# EAGLE design Calunium_v1 (EAGLE 5.11)
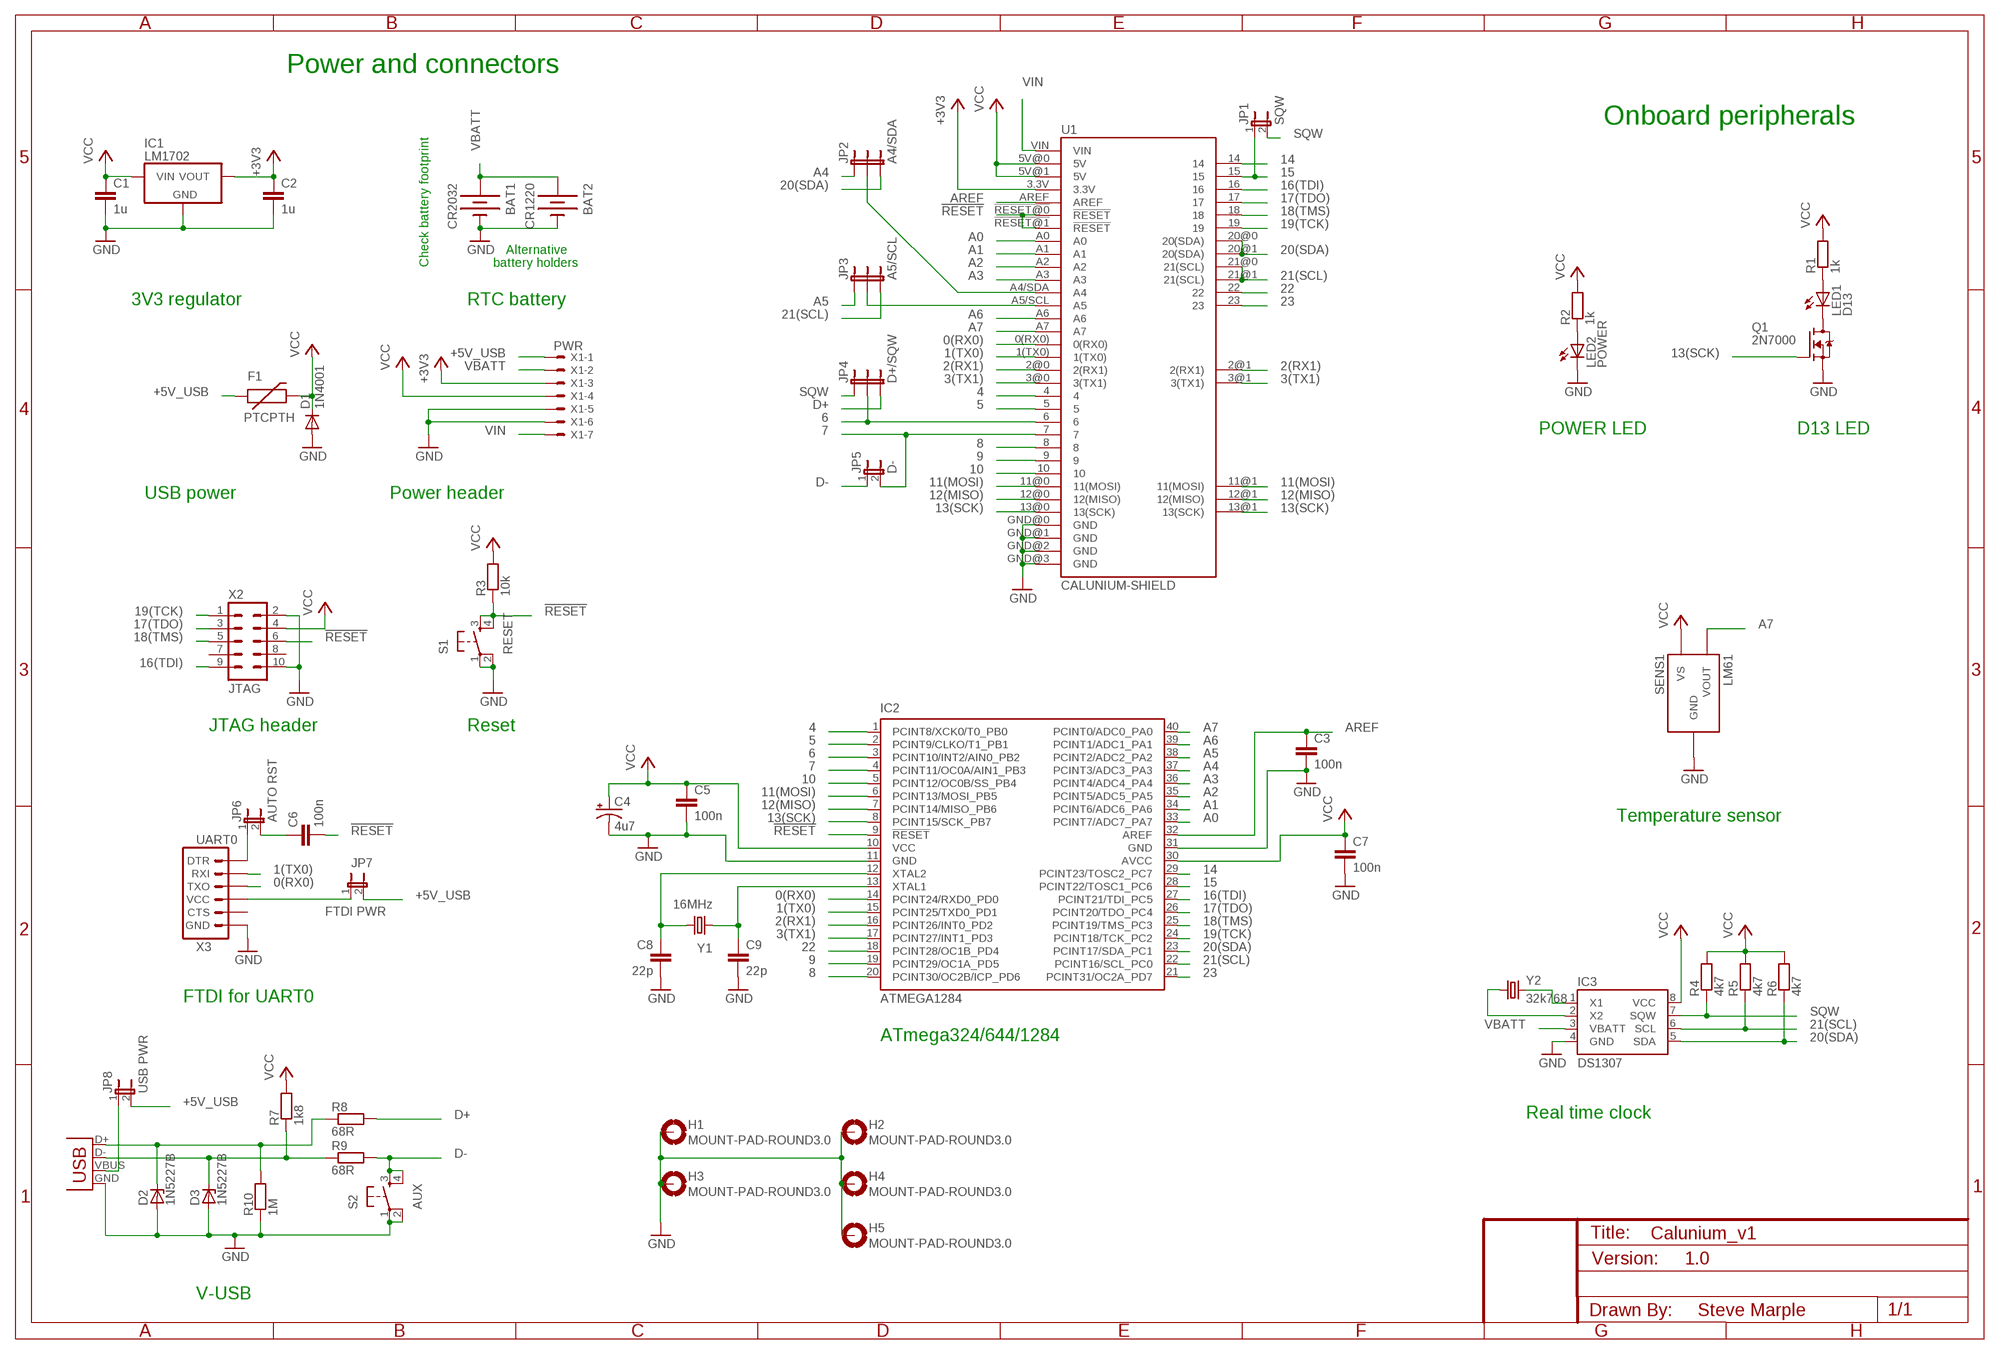
[diagram p0: schematic, sheet 1]

## Parts
BAT1  CR2032  BATTERY20PTH  [BATTCOM_20MM_PTH]
BAT2  CR1220  BATTERY12PTH  [BATTCON_12MM_PTH]
C1  1u  CAPPTH1  [CAP-PTH-5MM]
C2  1u  CAPPTH1  [CAP-PTH-5MM]
C3  100n  CAPPTH  [CAP-PTH-SMALL]
C4  4u7  CAP_POLPTH2  [CPOL-RADIAL-10UF-25V]
C5  100n  CAPPTH  [CAP-PTH-SMALL]
C6  100n  CAPPTH  [CAP-PTH-SMALL]
C7  100n  CAPPTH  [CAP-PTH-SMALL]
C8  22p  CAPPTH  [CAP-PTH-SMALL]
C9  22p  CAPPTH  [CAP-PTH-SMALL]
D1  1N4001  DIODEPTH  [DIODE-1N4001]
D2  1N5227B  ZENER-DIODEDO35Z10  [DO35Z10]
D3  1N5227B  ZENER-DIODEDO35Z10  [DO35Z10]
F1  PTCPTH  [PTC]
H1  MOUNT-PAD-ROUND3.0  [3,0-PAD]
H2  MOUNT-PAD-ROUND3.0  [3,0-PAD]
H3  MOUNT-PAD-ROUND3.0  [3,0-PAD]
H4  MOUNT-PAD-ROUND3.0  [3,0-PAD]
H5  MOUNT-PAD-ROUND3.0  [3,0-PAD]
IC1  LM1702  [TO-92]
IC2  ATMEGA1284  ATMEGA644-20PU  [DIL40]
IC3  DS1307  DS1307DIL08  [DIL08]
JP1  SQW  JUMPER-2PTH  [1X02]
JP2  A4/SDA  JUMPER-3PTH  [1X03]
JP3  A5/SCL  JUMPER-3PTH  [1X03]
JP4  D+/SQW  JUMPER-3PTH  [1X03]
JP5  D-  JUMPER-2PTH  [1X02]
JP6  AUTO RST  JUMPER-2PTH  [1X02]
JP7  FTDI PWR  JUMPER-2PTH  [1X02]
JP8  USB PWR  JUMPER-2PTH  [1X02]
LED1  D13  LED3MM  [LED3MM]
LED2  POWER  LED3MM  [LED3MM]
Q1  2N7000  [TO-92]
R1  1k  RESISTOR  [RES-AXIAL-0.4]
R2  1k  RESISTOR  [RES-AXIAL-0.4]
R3  10k  RESISTOR  [RES-AXIAL-0.4]
R4  4k7  RESISTOR  [RES-AXIAL-0.4]
R5  4k7  RESISTOR  [RES-AXIAL-0.4]
R6  4k7  RESISTOR  [RES-AXIAL-0.4]
R7  1k8  RESISTOR  [RES-AXIAL-0.4]
R8  68R  RESISTOR  [RES-AXIAL-0.4]
R9  68R  RESISTOR  [RES-AXIAL-0.4]
R10  1M  RESISTOR  [RES-AXIAL-0.4]
S1  RESET  TAC_SWITCHPTH  [TACTILE-PTH]
S2  AUX  TAC_SWITCHPTH  [TACTILE-PTH]
SENS1  LM61  [TO-92]
U1  CALUNIUM-SHIELD  [CALUNIUM-SHIELD-NO-OUTLINE-NO-HOLES]
X1  PWR  22-23-2071  [22-23-2071]
X2  JTAG  ATMEL-JTAG  [CON-HARTING-ML10]
X3  UART0  ARDUINO_SERIAL_PROGRAMRA_LOCK  [MOLEX-1X6-RA_LOCK]
X4  USBPTH  [USB-B-PTH]
Y1  16MHz  CRYSTALHC49UV  [HC49U-V]
Y2  32k768  CRYSTALTC38H  [TC38H]

## Nets
0(RX0): IC2.14(PCINT24/RXD0_PD0) U1.0(RX0) X3.4(TXO)
1(TX0): IC2.15(PCINT25/TXD0_PD1) U1.1(TX0) X3.5(RXI)
2(RX1): IC2.16(PCINT26/INT0_PD2) U1.2@0(2(RX1)) U1.2@1(2(RX1))
3(TX1): IC2.17(PCINT27/INT1_PD3) U1.3@0(3(TX1)) U1.3@1(3(TX1))
4: IC2.1(PCINT8/XCK0/T0_PB0) U1.4
5: IC2.2(PCINT9/CLKO/T1_PB1) U1.5
6: IC2.3(PCINT10/INT2/AIN0_PB2) JP4.2 U1.6
7: IC2.4(PCINT11/OC0A/AIN1_PB3) JP5.2 U1.7
8: IC2.20(PCINT30/OC2B/ICP_PD6) U1.8
9: IC2.19(PCINT29/OC1A_PD5) U1.9
10: IC2.5(PCINT12/OC0B/SS_PB4) U1.10
11(MOSI): IC2.6(PCINT13/MOSI_PB5) U1.11@0(11(MOSI)) U1.11@1(11(MOSI))
12(MISO): IC2.7(PCINT14/MISO_PB6) U1.12@0(12(MISO)) U1.12@1(12(MISO))
13(SCK): IC2.8(PCINT15/SCK_PB7) Q1.2(G) U1.13@0(13(SCK)) U1.13@1(13(SCK))
14: IC2.29(PCINT23/TOSC2_PC7) U1.14
15: IC2.28(PCINT22/TOSC1_PC6) JP1.1 U1.15
16(TDI): IC2.27(PCINT21/TDI_PC5) U1.16 X2.9(TDI)
17(TDO): IC2.26(PCINT20/TDO_PC4) U1.17 X2.3(TDO)
18(TMS): IC2.25(PCINT19/TMS_PC3) U1.18 X2.5(TMS)
19(TCK): IC2.24(PCINT18/TCK_PC2) U1.19 X2.1(TCK)
20(SDA): IC2.23(PCINT17/SDA_PC1) IC3.5(SDA) JP2.3 R6.P$1 U1.20@0(20(SDA)) U1.20@1(20(SDA))
21(SCL): IC2.22(PCINT16/SCL_PC0) IC3.6(SCL) JP3.3 R5.P$1 U1.21@0(21(SCL)) U1.21@1(21(SCL))
22: IC2.18(PCINT28/OC1B_PD4) U1.22
23: IC2.21(PCINT31/OC2A_PD7) U1.23
!RESET: C6.2 IC2.9(!RESET) R3.P$1 S1.3 S1.4 U1.!RESET@0(!RESET) U1.!RESET@1(!RESET) X2.6(!SRST)
+3V3 [power]: C2.1 IC1.3(VOUT) U1.3.3V X1.3
+5V_USB [power]: F1.P$1 JP7.2 JP8.2 X1.1
A0: IC2.33(PCINT7/ADC7_PA7) U1.A0
A1: IC2.34(PCINT6/ADC6_PA6) U1.A1
A2: IC2.35(PCINT5/ADC5_PA5) U1.A2
A3: IC2.36(PCINT4/ADC4_PA4) U1.A3
A4: IC2.37(PCINT3/ADC3_PA3) JP2.1
A5: IC2.38(PCINT2/ADC2_PA2) JP3.1
A6: IC2.39(PCINT1/ADC1_PA1) U1.A6
A7: IC2.40(PCINT0/ADC0_PA0) SENS1.2(VOUT) U1.A7
AREF: C3.1 IC2.32(AREF) U1.AREF
D+: JP4.3 R8.P$2
D-: JP5.1 R9.P$2 S2.3 S2.4
GND [power]: BAT1.2(-) BAT2.GND(-) C1.2 C2.2 C3.2 C4.2(-) C5.2 C7.2 C8.2 C9.2 D1.A D2.A D3.A H1.B3,0(MOUNT) H2.B3,0(MOUNT) H3.B3,0(MOUNT) H4.B3,0(MOUNT) H5.B3,0(MOUNT) IC1.1(GND) IC2.11(GND) IC2.31(GND) IC3.4(GND) LED2.K(C) Q1.1(S) R10.P$1 S1.1 S1.2 S2.1 S2.2 SENS1.3(GND) U1.GND@0(GND) U1.GND@1(GND) U1.GND@2(GND) U1.GND@3(GND) X1.5 X1.6 X2.2(GND) X2.10(GND) X3.1(GND) X4.GND
N$1: C9.1 IC2.13(XTAL1) Y1.1
N$2: C8.1 IC2.12(XTAL2) Y1.2
N$3: LED1.A R1.P$1
N$4: LED1.K(C) Q1.3(D)
N$5: IC3.1(X1) Y2.2
N$6: JP2.2 U1.A4/SDA(A4)
N$7: IC3.2(X2) Y2.1
N$8: LED2.A R2.P$1
N$9: JP8.1 X4.VBUS
N$10: JP7.1 X3.3(VCC)
N$11: D3.C R7.P$1 R9.P$1 X4.D-
N$13: JP3.2 U1.A5/SCL(A5)
N$15: JP6.1 X3.6(DTR)
N$16: C6.1 JP6.2
N$27: D2.C R8.P$1 R10.P$2 X4.D+
SQW: IC3.7(SQW) JP1.2 JP4.1 R4.P$1
VBATT: BAT1.1(+) BAT2.VCC@1(+) IC3.3(VBATT) X1.2
VCC [power]: C1.1 C4.1(+) C5.1 C7.1 D1.C F1.P$2 IC1.2(VIN) IC2.10(VCC) IC2.30(AVCC) IC3.8(VCC) R1.P$2 R2.P$2 R3.P$2 R4.P$2 R5.P$2 R6.P$2 R7.P$2 SENS1.1(VS) U1.5V@0(5V) U1.5V@1(5V) X1.4 X2.4(VTREF)
VIN [power]: U1.VIN X1.7
Unconnected: X2.7(NC) X2.8(NC) X3.2(CTS)

## Notes on the sheet
- Power and connectors
- Onboard peripherals
- Alternative
- Check battery footprint | battery holders
- 3V3 regulator | RTC battery
- POWER LED | D13 LED
- USB power | Power header
- JTAG header | Reset
- Temperature sensor
- FTDI for UART0
- ATmega324/644/1284
- Real time clock
- 1.0
- V-USB
- Steve Marple

## Library data of the parts
BAT1 BAT2 = SparkFun:BATTERY: Battery Holders Various common sizes : AA, AAA, 20mm coin cell and 12mm coin cell.
C1-C3 C5-C9 = SparkFun:CAP: Capacitor Standard 0603 ceramic capacitor, and 0.1" leaded capacitor.
C4 = SparkFun:CAP_POL: Capacitor Polarized These are standard SMD and PTH capacitors. Normally 10uF, 47uF, and 100uF in electrolytic and tantalum varieties. Always verify the external diameter of the through hole cap, it varies with capacity, voltage, and manufacturer. The EIA devices should be standard.
D1 = SparkFun:DIODE: Diode These are standard reverse protection diodes and small signal diodes. SMA package can handle up to about 1A. SOD-323 can handle about 200mA. What the SOD-323 package when ordering, there are some mfgs out there that are 5-pin packages.
D2 D3 = diode:ZENER-DIODE: Z-Diode
F1 = SparkFun:PTC: Resettable Fuse PTC Resettable Fuse. Spark Fun Electronics SKU : COM-08357
H1-H5 = holes:MOUNT-PAD-ROUND: MOUNTING PAD, round
IC1 = SteveMarple:LM1702
IC2 = atmel:ATMEGA644-*PU: 8-bit Microcontroller with 64K Bytes In-System Programmable Flash Auto generated by make-symbol-device-package-bsdl.ulp Rev. 34 Source: http://www.atmel.com/dyn/resources/prod_documents/doc2593.pdf; MPN: ATMEGA644-20PU; OC_FARNELL: 1288340; OC_NEWARK: 23M5060
IC3 = SteveMarple:DS1307
JP1 JP5-JP8 = SparkFun:JUMPER-2: Jumper Basic 0.1" spaced jumper. Use with breakaway headers.
JP2-JP4 = SparkFun:JUMPER-3
LED1 LED2 = SparkFun:LED: LEDs Standard schematic elements and footprints for 5mm, 3mm, 1206, and 0603 sized LEDs. 5mm - Spark Fun Electronics SKU : COM-00529 (and others)
Q1 = SteveMarple:2N7000: Microchip MCP1702 5V low dropout voltage regulator
R1-R10 = SteveMarple:RESISTOR: 1/4W PTH resistor
S1 S2 = SparkFun:TAC_SWITCH: Momentary Switch Button commonly used for reset or general input. Spark Fun Electronics SKU : COM-00097
SENS1 = SteveMarple:LM61
U1 = SteveMarple:CALUNIUM-SHIELD
X1 = con-molex:22-23-2071: .100" (2.54mm) Center Header - 7 Pin; MF: MOLEX; MPN: 22-23-2071; OC_FARNELL: 1654534; OC_NEWARK: 56H0445
X2 = SteveMarple:ATMEL-JTAG: ATMEL JTAG header
X3 = SparkFun:ARDUINO_SERIAL_PROGRAM
X4 = SteveMarple:USB: USB Connectors USB-B-PTH is fully proven SKU : PRT-00139 USB-miniB is fully proven SKU : PRT-00587 USB-A-PCB is untested. USB-A-H is throughly reviewed, but untested. Spark Fun Electronics SKU : PRT-00437 USB-B-SMT is throughly reviewed, but untested. Needs silkscreen touching up. USB-A-S has not been used/tested USB-MB-H has not been used/tested
Y1 Y2 = SparkFun:CRYSTAL: Crystals Various standard crystals. Proven footprints. Spark Fun Electronics SKU : COM-00534

## Net classes
1 power: width 0.381 mm

## Board
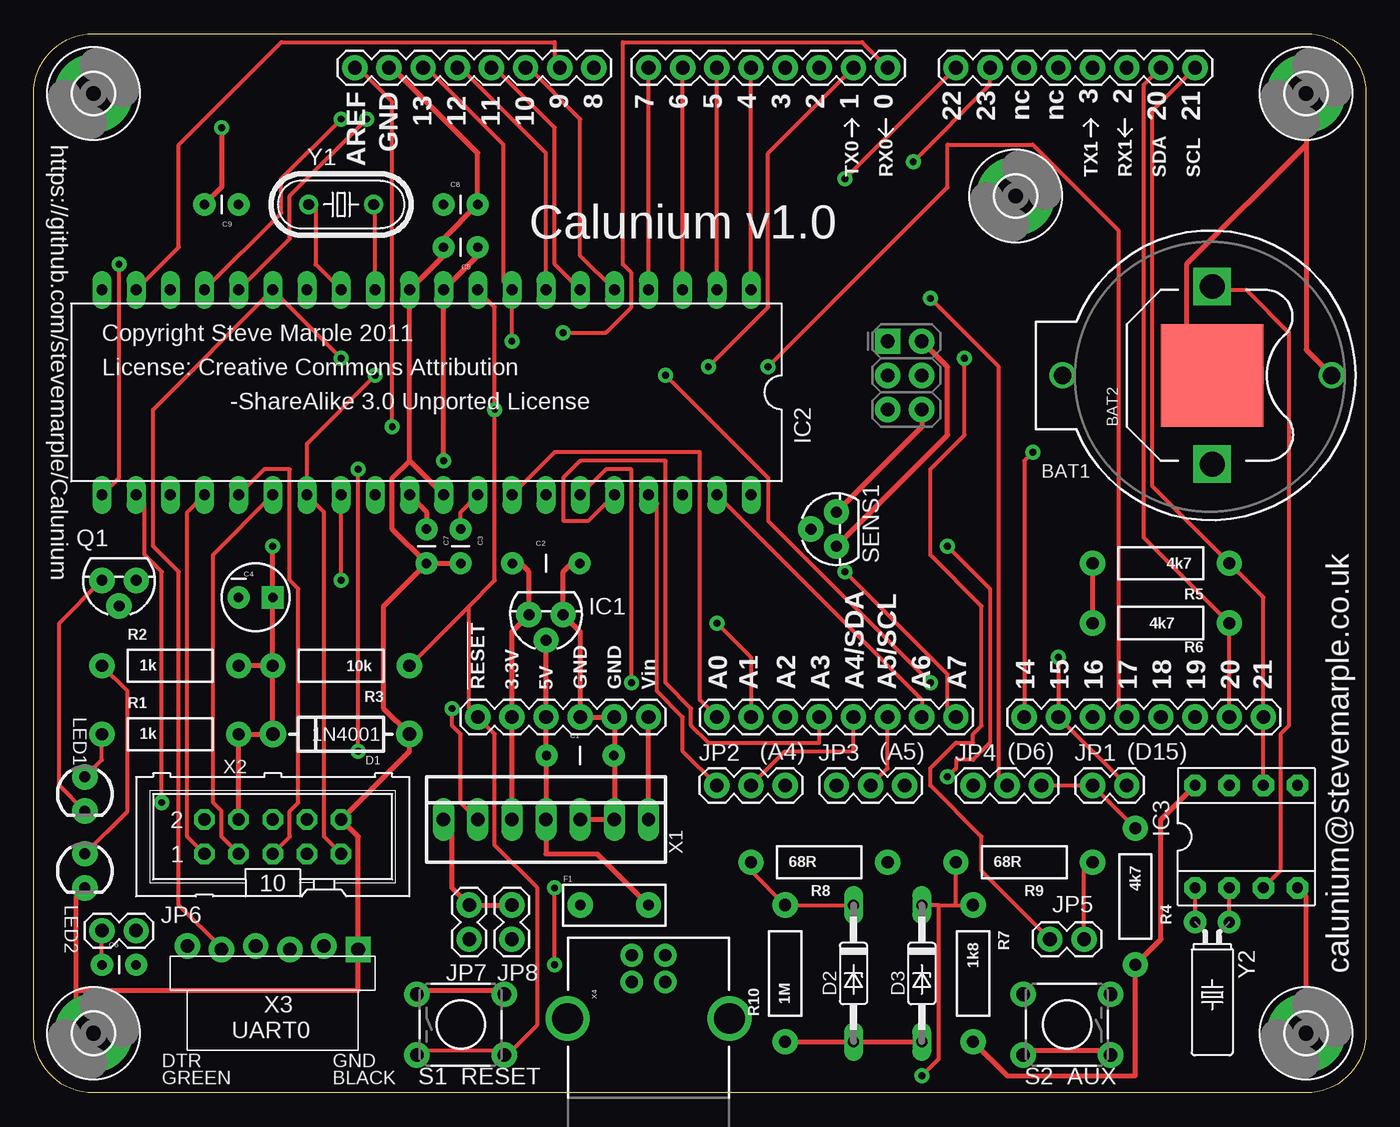
[diagram p1: board, top side]
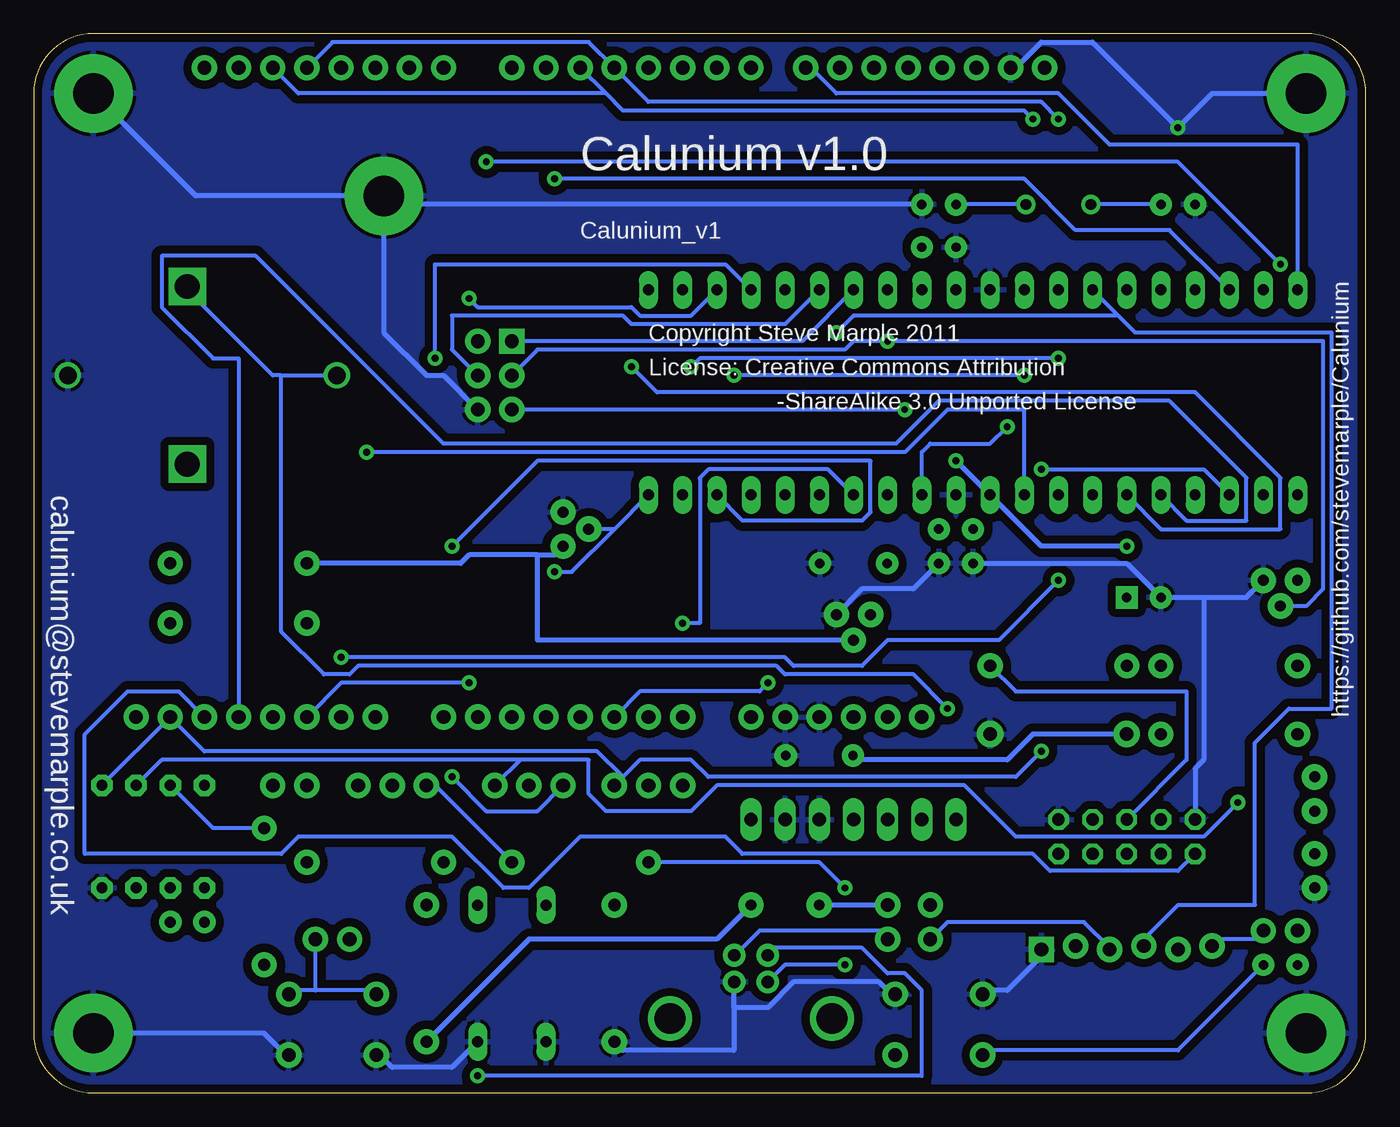
[diagram p2: board, bottom side, seen from below]

Size 99.06 x 78.74 mm. Coordinates in mm from the lower left corner, seen from the top.
Outline: 0,74.3 arc-90 4.45,78.74 94.61,78.74 arc-90 99.06,74.3 99.06,4.45 arc-90 94.61,0 4.45,0 arc-90 0,4.45 0,74.3
Copper layers (1*16): Top 0.035mm / dielectric 1.5mm / Bottom 0.035mm
Design rules "SparkFun_very_conservative": minimum track width 12mil, minimum drill 20mil, track to track 12mil, track to pad 12mil, pad to pad 12mil, via to via 12mil, smd to smd 12mil, copper to edge 10mil, drill to drill 8mil, minimum pad ring 12mil, minimum via ring 12mil, stop-mask expansion 4mil, vias tented up to drill 25mil, thermal gap 10mil

### Footprints (pad centres in the part's own frame; a part is rotated, then mirrored left to right if it is on the bottom)
BATTCOM_20MM_PTH = drill 1.3 round: 1 20,0; 2 0,0
BATTCON_12MM_PTH = smd 7.62 x 7.62: GND 0,0 | drill 1.854 square: VCC@1 -6.604,0; VCC@2 6.604,0
CAP-PTH-5MM = drill 0.7 pad 1.651 round: 1 -2.5,0; 2 2.5,0
CAP-PTH-SMALL = drill 0.7 pad 1.651 round: 1 0,0; 2 2.54,0
CPOL-RADIAL-10UF-25V = drill 0.7 pad 1.651 square: 1 1.27,0 | drill 0.7 pad 1.651 round: 2 -1.27,0
DIODE-1N4001 = drill 1 pad 1.981 round: A -5.08,0; C 5.08,0
DO35Z10 = drill 0.813 long: A 5.08,0; C -5.08,0
PTC = drill 0.8 pad 1.88 round: P$1 -2.54,0; P$2 2.54,0
3,0-PAD = drill 3 pad 5.842 round: B3,0 0,0
TO-92 = drill 0.813 pad 1.88 round: 1 -1.27,0; 2 0,1.905; 3 1.27,0
DIL40 = drill 0.813 long: 1 -24.13,-7.62; 2 -21.59,-7.62; 3 -19.05,-7.62; 4 -16.51,-7.62; 5 -13.97,-7.62; 6 -11.43,-7.62; 7 -8.89,-7.62; 8 -6.35,-7.62; 9 -3.81,-7.62; 10 -1.27,-7.62; 11 1.27,-7.62; 12 3.81,-7.62; 13 6.35,-7.62; 14 8.89,-7.62; 15 11.43,-7.62; 16 13.97,-7.62; 17 16.51,-7.62; 18 19.05,-7.62; 19 21.59,-7.62; 20 24.13,-7.62; 21 24.13,7.62; 22 21.59,7.62; 23 19.05,7.62; 24 16.51,7.62; 25 13.97,7.62; 26 11.43,7.62; 27 8.89,7.62; 28 6.35,7.62; 29 3.81,7.62; 30 1.27,7.62; 31 -1.27,7.62; 32 -3.81,7.62; 33 -6.35,7.62; 34 -8.89,7.62; 35 -11.43,7.62; 36 -13.97,7.62; 37 -16.51,7.62; 38 -19.05,7.62; 39 -21.59,7.62; 40 -24.13,7.62
DIL08 = drill 0.813 pad 1.6 octagon: 1 -3.81,-3.81; 2 -1.27,-3.81; 3 1.27,-3.81; 4 3.81,-3.81; 5 3.81,3.81; 6 1.27,3.81; 7 -1.27,3.81; 8 -3.81,3.81
1X02 = drill 1.016 pad 1.88 round: 1 0,0; 2 2.54,0
1X03 = drill 1.016 pad 1.88 round: 1 0,0; 2 2.54,0; 3 5.08,0
LED3MM = drill 0.813 pad 1.88 round: A -1.27,0; K 1.27,0
RES-AXIAL-0.4 = drill 0.9 pad 1.88 round: P$1 -5.08,0; P$2 5.08,0
TACTILE-PTH = drill 1.016 pad 1.88 round: 1 -3.251,2.261; 2 3.251,2.261; 3 -3.251,-2.261; 4 3.251,-2.261
CALUNIUM-SHIELD-NO-OUTLINE-NO-HOLES = drill 1.016 pad 1.88 round: 0(RX0) 0,21.59; 1(TX0) -2.54,21.59; 2@0 -5.08,21.59; 2@1 17.78,21.59; 3.3V -27.94,-26.67; 3@0 -7.62,21.59; 3@1 15.24,21.59; 4 -10.16,21.59; 5 -12.7,21.59; 5V@0 -25.4,-26.67; 5V@1 2.54,1.27; 6 -15.24,21.59; 7 -17.78,21.59; 8 -21.844,21.59; 9 -24.384,21.59; 10 -26.924,21.59; 11@0 -29.464,21.59; 11@1 2.54,-1.27; 12@0 -32.004,21.59; 13@0 -34.544,21.59; 13@1 0,-1.27; 14 10.16,-26.67; 15 12.7,-26.67; 16 15.24,-26.67; 17 17.78,-26.67; 18 20.32,-26.67; 19 22.86,-26.67; 20@0 25.4,-26.67; 20@1 20.32,21.59; 21@0 27.94,-26.67; 21@1 22.86,21.59; 22 5.08,21.59; 23 7.62,21.59; !RESET@0 -30.48,-26.67; !RESET@1 0,-3.81; A0 -12.7,-26.67; A1 -10.16,-26.67; A2 -7.62,-26.67; A3 -5.08,-26.67; A4/SDA -2.54,-26.67; A5/SCL 0,-26.67; A6 2.54,-26.67; A7 5.08,-26.67; AREF -39.624,21.59; GND@0 -22.86,-26.67; GND@1 -20.32,-26.67; GND@2 -37.084,21.59; GND@3 2.54,-3.81; NC@0 12.7,21.59; NC@1 10.16,21.59; VIN -17.78,-26.67 | drill 1.016 pad 1.88 square: 12@1 0,1.27
22-23-2071 = drill 1 long: 1 -7.62,0; 2 -5.08,0; 3 -2.54,0; 4 0,0; 5 2.54,0; 6 5.08,0; 7 7.62,0
CON-HARTING-ML10 = drill 0.914 octagon: 1 -5.08,-1.27; 2 -5.08,1.27; 3 -2.54,-1.27; 4 -2.54,1.27; 5 0,-1.27; 6 0,1.27; 7 2.54,-1.27; 8 2.54,1.27; 9 5.08,-1.27; 10 5.08,1.27
MOLEX-1X6-RA_LOCK = drill 1.016 pad 1.88 square: 1 0,0.127 | drill 1.016 pad 1.88 round: 2 2.54,-0.127; 3 5.08,0.127; 4 7.62,-0.127; 5 10.16,0.127; 6 12.7,-0.127
USB-B-PTH = drill 0.914 pad 1.676 round: D+ 0,1.25; D- 1.981,1.25; GND 0,-1.25; VBUS 1.981,-1.25 | drill 2.286 round: S1 -2.718,-6.02; S2 -2.718,6.02
HC49U-V = drill 0.813 round: 1 -2.413,0; 2 2.413,0
TC38H = drill 0.813 pad 1.676 round: 1 -1.27,0; 2 1.27,0

### Placement (x,y rotation side)
BAT1  96.52,53.34 180 top
BAT2  87.63,53.34 270 top
C1  40.64,25.08 0 top
C2  38.1,39.37 0 top
C3  31.75,41.91 270 top
C4  16.51,36.83 0 top
C5  33.02,62.87 180 top
C6  5.08,9.53 0 top
C7  29.21,41.91 270 top
C8  30.48,66.04 0 top
C9  15.24,66.04 180 top
D1  22.86,26.67 180 top
D2  60.96,8.89 270 top
D3  66.04,8.89 270 top
F1  43.18,13.97 0 top
H1  94.61,4.45 0 top
H2  4.45,4.45 0 top
H3  4.45,74.3 0 top
H4  94.61,74.3 0 top
H5  73.03,66.67 0 top
IC1  38.1,35.56 180 top
IC2  29.21,52.07 180 top
IC3  90.17,19.05 0 top
JP1  81.28,22.86 180 top
JP2  50.8,22.86 0 top
JP3  59.69,22.86 0 top
JP4  74.93,22.86 180 top
JP5  78.11,11.43 180 top
JP6  7.62,12.06 180 top
JP7  32.38,11.43 90 top
JP8  35.56,11.43 90 top
LED1  3.81,22.23 270 top
LED2  3.81,16.51 270 top
Q1  6.35,38.1 180 top
R1  10.16,26.67 0 top
R2  10.16,31.75 0 top
R3  22.86,31.75 180 top
R4  81.92,14.61 270 top
R5  83.82,39.37 180 top
R6  83.82,34.92 180 top
R7  69.85,8.89 270 top
R8  58.42,17.14 0 top
R9  73.66,17.14 0 top
R10  55.88,8.89 90 top
S1  31.75,5.08 0 top
S2  76.83,5.08 180 top
SENS1  59.69,41.91 90 top
U1  63.5,54.61 0 top
X1  38.1,20.32 0 top
X2  17.78,19.05 0 top
X3  24.13,10.79 180 top
X4  45.72,8.26 90 top
Y1  22.86,66.04 0 top
Y2  87.63,12.7 180 top

### Tracks (layer width: path | path; a pad name or v marks a point on that pad's centre or on a via)
0(RX0)  (via drill 0.51)
  Top 0.305: U1.0(RX0) 61.59,78.11 43.81,78.11 43.81,61.59 44.45,60.96 44.45,58.42 42.55,56.52 v39.37,56.52
  Bottom 0.305: 18.41,57.78 17.14,56.52 2.54,56.52 2.54,28.57 5.71,28.57 8.26,26.04 8.26,13.97 13.97,13.97 16.51,11.43 X3.4 | 18.41,57.78 IC2.14 | v39.37,56.52 38.1,57.78 18.41,57.78
1(TX0)  (via drill 0.51)
  Top 0.305: X3.5 13.97,10.79 10.79,13.97 10.79,38.73 8.89,40.64 8.89,50.8 IC2.15 v22.86,54.61 | U1.1(TX0) 54.61,69.85 54.61,58.42 v50.16,53.98
  Bottom 0.305: v50.16,53.98 49.53,54.61 v22.86,54.61
2(RX1)  (via drill 0.51)
  Top 0.305: IC2.16 19.05,63.5 19.05,66.67 v24.77,72.39
  Bottom 0.305: v24.77,72.39 25.4,73.03 55.24,73.03 56.52,74.3 | 56.52,74.3 U1.2@0 | U1.2@1 79.38,74.3 56.52,74.3
3(TX1)  (via drill 0.51)
  Top 0.305: IC2.17 18.41,65.41 18.41,67.94 v22.86,72.39
  Bottom 0.305: v22.86,72.39 24.13,73.66 53.34,73.66 U1.3@0 57.78,78.11 76.83,78.11 U1.3@1
4
  Top 0.305: IC2.1 U1.4
5
  Top 0.305: IC2.2 U1.5
6  (via drill 0.51)
  Top 0.305: IC2.3 U1.6 | JP4.2 71.75,23.5 71.75,53.98 v66.67,59.05
  Bottom 0.305: v66.67,59.05 66.04,58.42 54.61,58.42 53.98,57.78 50.16,57.78 IC2.3
7  (via drill 0.51)
  Top 0.305: IC2.4 U1.7 | JP5.2 70.48,16.51 70.48,19.05 66.67,22.86 66.67,24.13 68.58,26.04 69.85,26.04 69.85,26.67 70.48,27.3 70.48,36.2 66.67,40.01 66.67,46.35 69.22,48.9 v69.22,54.61
  Bottom 0.305: v69.22,54.61 69.22,61.59 47.62,61.59 IC2.4
8
  Bottom 0.305: IC2.20 5.08,70.48 19.05,70.48 22.86,74.3 39.37,74.3 41.27,76.2 U1.8
9
  Top 0.305: IC2.19 10.79,62.87 10.79,70.48 18.41,78.11 38.73,78.11 38.73,76.2 U1.9
10
  Top 0.305: IC2.5 40.64,62.23 40.64,72.39 36.83,76.2 U1.10
11(MOSI)
  Top 0.305: IC2.6 38.73,61.59 38.73,71.75 34.29,76.2 U1.11@0
  Bottom 0.305: U1.11@1 67.94,55.24 67.94,57.78 55.24,57.78 54.61,57.15 43.18,57.15 IC2.6
12(MISO)
  Top 0.305: IC2.7 38.1,69.85 31.75,76.2 U1.12@0
  Bottom 0.305: IC2.7 41.91,55.88 U1.12@1
13(SCK)  (via drill 0.51)
  Top 0.305: U1.13@0 29.21,76.2 34.92,70.48 34.92,60.33 IC2.8 v35.56,55.88
  Bottom 0.305: Q1.2 4.45,36.2 3.17,37.47 3.17,55.88 v35.56,55.88 38.1,55.88 38.73,55.24 61.59,55.24 U1.13@1
14  (via drill 0.51)
  Top 0.305: v74.3,47.62 73.66,46.99 U1.14
  Bottom 0.305: IC2.29 25.4,50.8 31.11,50.8 34.29,47.62 v74.3,47.62
15  (via drill 0.51)
  Top 0.305: v22.86,38.1 IC2.28 | v76.2,32.38 U1.15 JP1.1
  Bottom 0.305: v22.86,38.1 27.3,33.66 35.56,33.66 37.47,31.75 42.55,31.75 43.18,32.38 v76.2,32.38
16(TDI)  (via drill 0.51)
  Top 0.305: X2.9 21.59,19.05 21.59,43.18 IC2.27 20.32,48.26 v25.4,53.34 | v66.67,30.48 54.61,42.55 54.61,45.72 v46.99,53.34
  Bottom 0.305: U1.16 76.2,30.48 v66.67,30.48 | v25.4,53.34 v46.99,53.34
17(TDO)  (via drill 0.51)
  Top 0.305: IC2.26 13.34,40.01 13.34,21.59 13.97,20.95 13.97,19.05 X2.3 | U1.17 80.64,28.57 80.64,64.14 74.3,70.48 67.94,70.48 67.94,67.31 v54.61,53.98
  Bottom 0.305: v54.61,53.98 52.7,52.07 12.7,52.07 6.35,45.72 6.35,41.91 15.24,41.91 IC2.26
18(TMS)
  Top 0.305: IC2.25 17.14,46.35 19.05,46.35 19.05,38.1 19.68,37.47 19.68,21.59 19.05,20.95 19.05,19.05 X2.5
  Bottom 0.305: U1.18 83.82,54.61 85.72,54.61 89.53,58.42 89.53,62.23 82.55,62.23 68.58,48.26 34.92,48.26 31.75,51.44 14.61,51.44 8.89,45.72 8.89,42.55 13.34,42.55 IC2.25
19(TCK)
  Top 0.305: IC2.24 11.43,43.18 11.43,19.05 X2.1
  Bottom 0.305: U1.19 88.27,29.84 92.08,29.84 95.25,26.67 95.25,17.78 80.64,17.78 79.38,19.05 67.94,19.05 64.14,15.24 62.23,15.24 58.42,19.05 47.62,19.05 46.35,17.78 24.77,17.78 23.5,16.51 13.97,16.51 X2.1
20(SDA)  (via drill 0.51)
  Top 0.305: U1.20@0 R6.P$1 82.55,41.27 82.55,74.93 U1.20@1 | v24.13,25.4 v24.13,46.35
  Bottom 0.305: IC3.5 U1.20@0 86.36,25.4 57.15,25.4 55.24,23.5 | IC2.23 12.06,46.35 v24.13,46.35 | v24.13,25.4 26.04,23.5 48.9,23.5 50.16,24.77 53.98,24.77 55.24,23.5 | 55.24,23.5 JP2.3
21(SCL)  (via drill 0.51)
  Top 0.305: IC3.6 U1.21@0 91.44,36.83 R5.P$1 83.19,45.09 83.19,73.03 U1.21@1 | IC2.22 8.26,43.81 8.26,40.01 9.53,38.73 v9.53,21.59
  Bottom 0.305: v9.53,21.59 12.06,19.05 26.04,19.05 29.84,22.86 48.26,22.86 50.16,20.95 56.52,20.95 57.78,22.23 57.78,24.77 62.87,24.77 | 62.87,24.77 JP3.3 | IC3.6 89.53,24.77 62.87,24.77
22  (via drill 0.51)
  Top 0.305: v60.33,67.94 U1.22
  Bottom 0.305: IC2.18 14.61,64.14 21.59,64.14 25.4,67.94 v60.33,67.94
23  (via drill 0.51)
  Top 0.305: IC2.21 6.35,45.72 v6.35,61.59 | v65.41,69.22 71.12,74.93 U1.23
  Bottom 0.305: v6.35,61.59 13.97,69.22 v65.41,69.22
!RESET  (via drill 0.51)
  Top 0.305: S1.3 28.57,3.17 34.92,3.17 S1.4 35.56,3.17 37.47,5.08 37.47,15.24 34.29,18.41 34.29,26.67 U1.!RESET@0 32.38,28.57 32.38,36.2 | IC2.9 34.29,58.42 v34.29,50.8 34.29,38.1 32.38,36.2 | 32.38,36.2 R3.P$1
  Bottom 0.305: C6.2 13.97,3.17 27.94,3.17 S1.3 | X2.6 13.34,24.77 13.34,29.84 26.04,29.84 R3.P$1 | v34.29,50.8 U1.!RESET@1
+3V3
  Top 0.381: C2.1 36.2,39.37 36.83,38.73 IC1.3 35.56,34.29 U1.3.3V X1.3
+5V_USB
  Top 0.381: X1.1 31.11,19.68 31.11,15.24 JP7.2 JP8.2
  Bottom 0.381: JP8.2 F1.P$1
A0
  Top 0.305: IC2.33 38.73,47.62 49.53,47.62 49.53,29.21 U1.A0
A1  (via drill 0.51)
  Top 0.305: v50.8,34.92 53.34,32.38 U1.A1
  Bottom 0.305: IC2.34 40.01,46.35 48.9,46.35 49.53,45.72 49.53,34.92 v50.8,34.92
A2  (via drill 0.51)
  Top 0.305: IC2.35 42.55,46.35 44.45,46.35 v44.45,30.48
  Bottom 0.305: v44.45,30.48 45.09,29.84 53.98,29.84 U1.A2
A3
  Top 0.305: IC2.36 41.27,42.55 39.37,42.55 39.37,45.72 40.64,46.99 46.99,46.99 46.99,30.48 48.9,28.57 48.9,27.3 50.16,26.04 58.42,26.04 U1.A3
A4
  Top 0.305: IC2.37 46.35,43.81 46.35,29.84 48.26,27.94 48.26,25.4 JP2.1
A5  (via drill 0.51)
  Top 0.305: v67.94,40.64 71.12,37.47 71.12,26.04 69.85,24.77 68.58,24.77 68.58,24.13 v67.94,23.5
  Bottom 0.305: IC2.38 46.35,42.55 37.47,42.55 36.83,43.18 36.83,46.99 61.59,46.99 v67.94,40.64 | v67.94,23.5 65.41,20.95 61.59,20.95 JP3.1
A6
  Top 0.305: IC2.39 66.04,29.21 U1.A6
A7  (via drill 0.51)
  Top 0.305: U1.A7 67.94,28.57 67.94,31.11 v60.33,38.73
  Bottom 0.305: 55.88,41.91 IC2.40 | 55.88,41.91 SENS1.2 | v60.33,38.73 59.05,38.73 55.88,41.91
AREF  (via drill 0.51)
  Top 0.305: IC2.32 31.75,43.18 C3.1 | v26.67,49.53 26.67,73.66 24.13,76.2 U1.AREF
  Bottom 0.305: v26.67,49.53 27.94,48.26 32.38,48.26 33.02,47.62 IC2.32
D+
  Bottom 0.305: R8.P$2 69.22,22.86 JP4.3
D-
  Top 0.305: R9.P$2 78.11,16.51 JP5.1
  Bottom 0.305: 78.11,7.62 80.01,7.62 S2.3 | 78.11,7.62 73.66,7.62 S2.4 | 78.11,7.62 JP5.1
GND  (via drill 0.51)
  Top 0.381: LED2.K 3.17,14.61 3.17,7.62 | 3.17,7.62 3.17,5.71 H2.B3,0 | S1.2 34.92,7.62 28.57,7.62 S1.1 | 3.17,7.62 24.13,7.62 X3.1 24.13,19.05 X2.10 27.94,25.4 D1.A 26.04,28.57 26.04,36.2 C7.2 | R10.P$1 D2.A D3.A | S2.2 73.66,3.17 80.01,3.17 S2.1 | IC3.4 94.61,14.61 H1.B3,0 | BAT1.2 94.61,55.24 94.61,70.48 | H4.B3,0 94.61,70.48 | BAT2.GND 85.72,55.24 85.72,61.59 94.61,70.48 | SENS1.3 66.04,49.53 U1.GND@3 | C9.2 13.97,67.31 v13.97,71.75 | C2.2 40.01,39.37 39.37,38.73 IC1.1 40.64,34.29 U1.GND@0 U1.GND@1 43.18,25.4 C1.2 43.18,24.77 X1.6 X1.5 | C7.2 C3.2 | 27.94,46.99 IC2.31 | 27.94,46.99 IC2.11 30.48,62.23 C5.2 30.48,63.5 C8.2 33.02,69.85 26.67,76.2 U1.GND@2 | C7.2 26.67,41.91 26.67,45.72 27.94,46.99
  Bottom 0.381: X3.1 24.13,10.16 26.67,7.62 27.94,7.62 S1.1 | 46.99,6.35 46.99,3.17 55.24,3.17 R10.P$1 | 46.99,6.35 46.99,8.26 X4.GND | H1.B3,0 81.92,4.45 80.64,3.17 S2.1 | D3.A 67.94,1.91 72.39,1.91 73.03,2.54 S2.2 | 46.99,6.35 44.45,6.35 42.55,8.26 36.2,8.26 35.56,7.62 S1.2 | U1.GND@3 68.58,53.34 69.85,53.34 73.03,56.52 73.03,66.04 | H4.B3,0 87,66.67 H5.B3,0 73.03,66.04 | H3.B3,0 11.43,74.3 v13.97,71.75 20.32,78.11 24.13,78.11 26.04,76.2 U1.GND@2 | X2.2 12.7,24.13 12.06,24.77 12.06,36.83 | 12.06,36.83 C4.2 17.78,39.37 C7.2 | Q1.1 8.89,36.83 12.06,36.83 | IC1.1 37.47,37.47 33.66,37.47 C3.2 | C8.2 73.03,66.04
  pour Bottom (isolate 0.61): -2.54,81.28 101.6,81.28 101.6,-2.54 -2.54,-2.54
N$1
  Top 0.305: IC2.13 20.95,61.59 20.95,66.04 Y1.1
  Bottom 0.305: C9.1 Y1.1
N$2
  Top 0.305: IC2.12 25.4,66.04 Y1.2
  Bottom 0.305: Y1.2 C8.1
N$3
  Top 0.305: LED1.A 5.08,24.77 R1.P$1
N$4
  Top 0.305: LED1.K 1.91,22.86 1.91,34.92 Q1.3
N$5
  Top 0.305: Y2.2 IC3.1
N$6
  Top 0.305: JP2.2 55.88,25.4 60.96,25.4 U1.A4/SDA
N$7
  Top 0.305: Y2.1 IC3.2
N$8
  Top 0.305: LED2.A 6.99,20.95 6.99,29.84 R2.P$1
N$9
  Bottom 0.305: JP8.1 36.2,12.06 45.09,12.06 46.35,10.79 X4.VBUS
N$10
  Bottom 0.305: JP7.1 31.11,12.7 20.95,12.7 19.05,10.79 X3.3
N$11  (via drill 0.51)
  Top 0.305: 68.58,13.97 R7.P$1 | 67.31,13.97 68.58,13.97 | 67.31,13.97 D3.C | v66.04,1.27 67.31,2.54 67.31,13.97 | 68.58,13.97 R9.P$1
  Bottom 0.305: v66.04,1.27 33.02,1.27 33.02,7.62 34.29,8.89 35.56,8.89 37.47,10.79 44.45,10.79 X4.D-
N$13
  Top 0.305: JP3.2 63.5,24.13 U1.A5/SCL
N$15
  Bottom 0.305: JP6.1 8.26,11.43 11.43,11.43 X3.6
N$16
  Top 0.305: C6.1 JP6.2
N$27  (via drill 0.51)
  Top 0.305: D2.C R10.P$2 53.34,16.51 R8.P$1 | v38.73,9.53 v38.73,15.24
  Bottom 0.305: v38.73,9.53 43.18,9.53 44.45,8.26 X4.D+ | v38.73,15.24 40.64,17.14 R8.P$1
SQW
  Top 0.305: JP4.1 JP1.2 R4.P$1
  Bottom 0.305: IC3.7 85.72,19.68 R4.P$1
VBATT  (via drill 0.51)
  Top 0.305: IC3.3 92.71,16.51 92.71,26.67 93.34,27.3 93.34,56.52 90.17,59.69 87.63,59.69 BAT2.VCC@1 | X1.2 31.75,21.59 31.75,26.67 31.11,27.3 v31.11,28.57
  Bottom 0.305: v31.11,28.57 33.66,31.11 43.18,31.11 43.81,31.75 74.93,31.75 75.56,31.11 77.47,31.11 80.64,34.29 80.64,53.34 | 80.64,53.34 BAT1.1 | 80.64,53.34 81.28,53.34 87.63,59.69 BAT2.VCC@1
VCC  (via drill 0.51)
  Top 0.381: R5.P$2 R6.P$2 | U1.5V@1 67.94,53.98 67.94,48.9 SENS1.1 | IC3.8 83.82,20.32 83.82,11.43 R4.P$2 81.92,1.27 72.39,1.27 R7.P$2 | F1.P$2 41.91,17.78 38.1,17.78 X1.4 38.1,24.77 C1.1 38.1,25.4 U1.5V@0 IC1.2 | X2.4 R1.P$2 D1.C R3.P$2 | C5.1 33.02,62.23 IC2.10 v30.48,46.99 | IC2.30 29.21,43.18 C7.1 | R3.P$2 C4.1 v17.78,40.64 | R3.P$2 R2.P$2
  Bottom 0.381: SENS1.1 60.33,40.01 61.59,40.01 | 61.59,40.01 66.67,40.01 67.31,39.37 R5.P$2 | v17.78,40.64 24.13,40.64 IC2.30 v30.48,46.99 | D1.C 24.77,26.67 26.67,24.77 38.1,24.77 C1.1 | R7.P$2 62.23,11.43 48.26,11.43 F1.P$2 | 61.59,40.01 61.59,33.66 IC1.2
VIN
  Top 0.381: X1.7 U1.VIN

### Text on the board
tNames: (A4) | (A5) | (D6) | (D15) | DTR | GND | GREEN | BLACK | RESET | AUX
_tsilk: https://github.com/stevemarple/Calunium | Calunium v1.0 | Copyright Steve Marple 2011 | License: Creative Commons Attribution | -ShareAlike 3.0 Unported License | calunium@stevemarple.co.uk
_bsilk: Calunium v1.0 | Copyright Steve Marple 2011 | License: Creative Commons Attribution | -ShareAlike 3.0 Unported License | calunium@stevemarple.co.uk | https://github.com/stevemarple/Calunium